# EasyEDA Pro project ProPrj_磁编码器AS5600_2025-07-28.epro

# Schematic Schematic1
Board Name: Board1; Create Date: 2025-05-22; Page Name: P1; Project Name: 磁编码器AS5600; Schematic Name: Schematic1; Update Date: 2025-05-22; Company: 嘉立创EDA; Page Size: A4; Version: V1.0
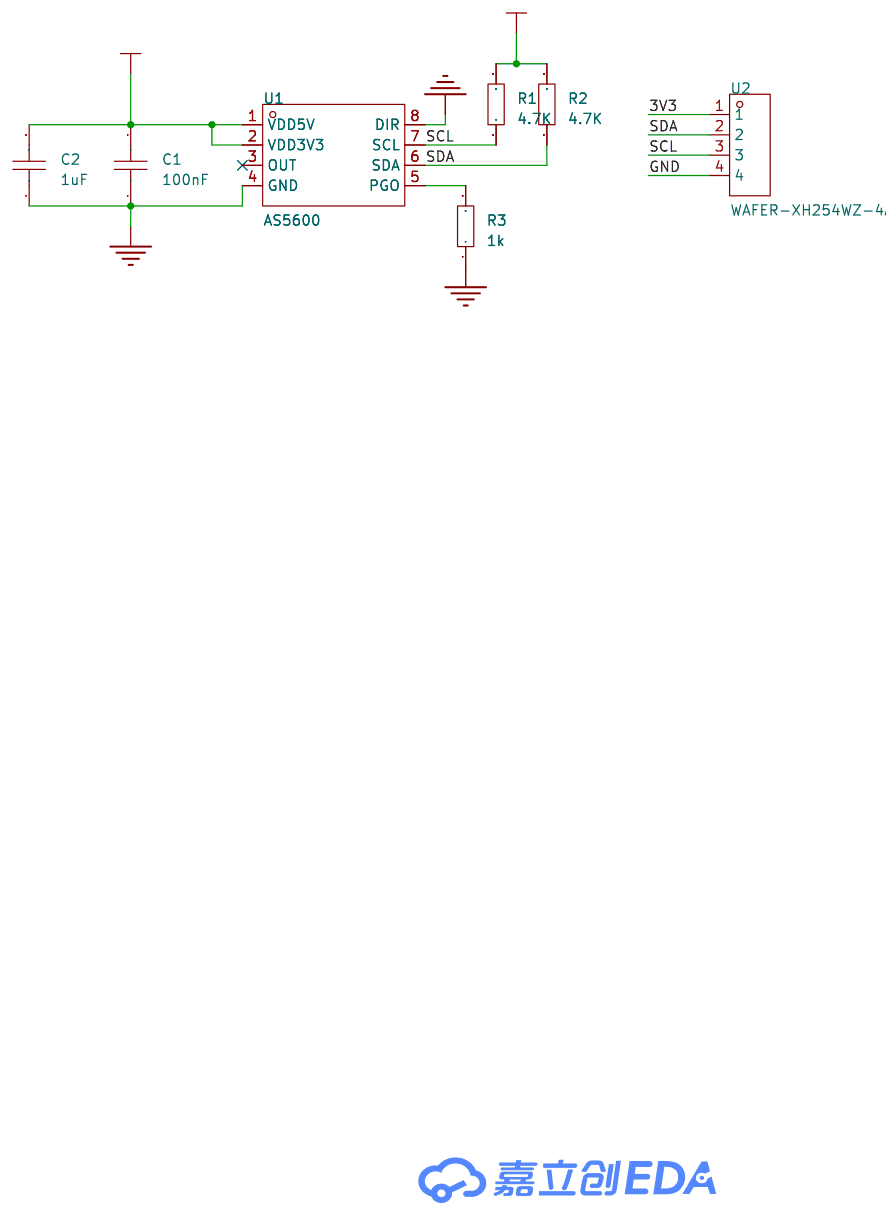
[diagram p0: schematic sheet]

## Parts
C1  100nF  [C0603]
C2  1uF  [C0603]
R1  4.7K  [R0603]
R2  4.7K  [R0603]
R3  1k  [R0603]
U1  AS5600  [SOIC-8_L4.9-W3.9-P1.27-LS6.0-BL]
U2  WAFER-XH254WZ-4A  [CONN-TH_4P-P2.50_WAFER-XH254WZ-4A]

## Library data of the parts
C1 C2 = CAP_0603: Supplier Footprint: 0603
R1-R3 = Res_0603: Supplier Footprint: 0603
U1 = AS5600: Supplier Part: C9900021040; Supplier Footprint: SOIC-8; JLCPCB Part Class: 扩展库; Supplier: LCSC
U2 = WAFER-XH254WZ-4A: 插针结构:1x4P;间距:2.54mm;安装方式:弯插;参考系列:XH;总PIN数:4P;排数:1;每排PIN数:4;额定电流:3A;触头材质:黄铜;工作温度:-25℃~+85℃;; LCSC Part Name: 1x4P 间距:2.54mm 弯插 系列:XH; Supplier Part: C7432693; Manufacturer: HANBO(汉博); Supplier Footprint: 插件,P=2.5mm; Datasheet: https://atta.szlcsc.com/upload/public/pdf/source/20230721/127D646758C1D4B76FEF9901992220E1.pdf; Supplier: LCSC; Pins Structure: 1x4P; Pitch: 2.54mm; Mounting Type: 弯插; Reference Series: XH; Number of Pins: 4P; Number of Rows: 1; Number of PINs Per Row: 4; Current Rating: 3A; Contact Material: 黄铜; Operating Temperature: -25℃~+85℃; Voltage Rating: 250V; Plastic Material: PA66; Flame Retardant Rating: UL94V-0

## Nets
3V3: C1.2 C2.2 R1.2 R2.2 U1.1(VDD5V) U1.2(VDD3V3) U2.1
GND: C1.1 C2.1 R3.1 U1.4(GND) U1.8(DIR) U2.4
SCL: R1.1 U1.7(SCL) U2.3
SDA: R2.1 U1.6(SDA) U2.2
$1N1180: R3.2 U1.5(PGO)

Not connected (* = marked no-connect by the designer): U1 3(OUT)*

# Board PCB1
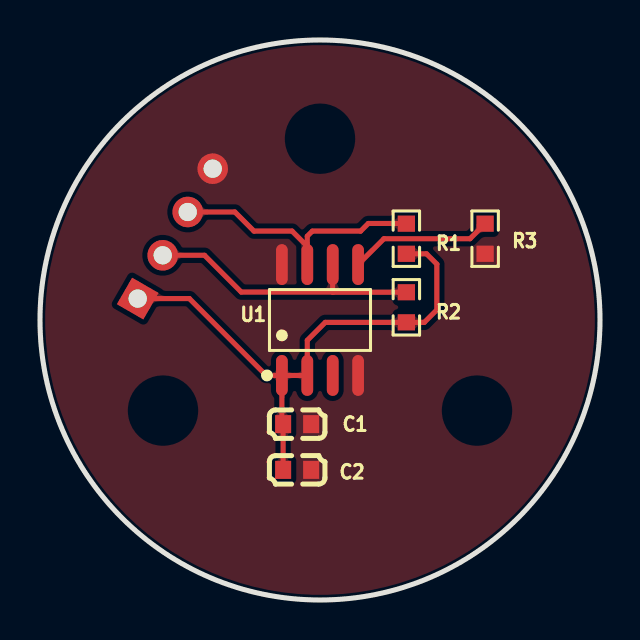
[diagram p1: board, top side]
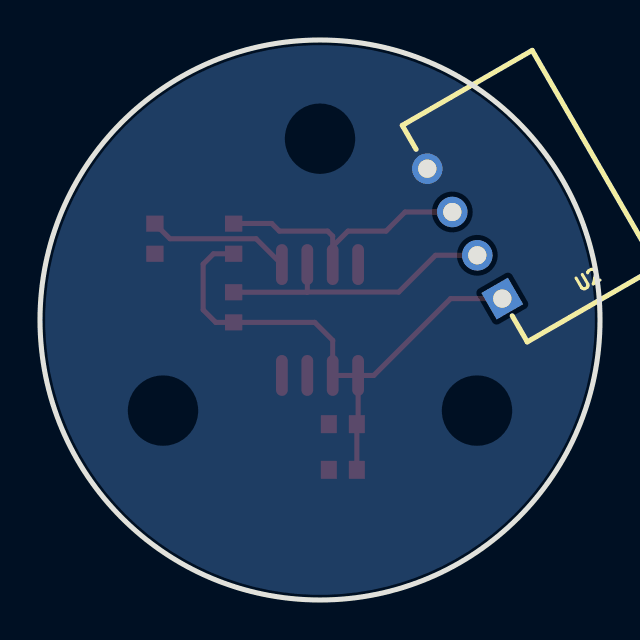
[diagram p2: board, bottom side, seen from below]

Outline 28 x 28 mm; copper layers: Top Layer, Bottom Layer. Coordinates in mm from the lower left corner of the outline.
Outline path: circle c14,14 r14
Stack: Top Layer 0.035mm / Dielectric1 1.51mm FR4 er 4.5 / Bottom Layer 0.035mm

## Design rules (mm)
template: 自定义配置
spacing copperThickness1oz (default): track to track 0.102, other pairs 0.152 to 0.3
spacing copperThickness2oz: track to track 0.203, other pairs 0.152 to 0.3
track width copperThickness1oz (default): min 0.127, default 0.254, max 2.54
track width copperThickness2oz: min 0.203, default 0.254, max 2.54
differential pair differentialPair (default): width min 0.127, default 0.254, max 2.54; gap min 0.152, default 0.152
via viaSize (default): diameter min 0.5, default 0.61, max 10; hole min 0.3, default 0.305, max 6.3

## Placement (name value [footprint] x y rotation side)
C1  100nF  [C0603]  12.86 8.79 180 top
C2  1uF  [C0603]  12.86 6.51 180 top
R1  4.7K  [R0603]  18.32 18.06 270 top
R2  4.7K  [R0603]  18.32 14.64 270 top
R3  1k  [R0603]  22.25 18.06 90 top
U1  AS5600  [SOIC-8_L4.9-W3.9-P1.27-LS6.0-BL]  14 14 0 top
U2  WAFER-XH254WZ-4A  [CONN-TH_4P-P2.50_WAFER-XH254WZ-4A]  6.76 18.32 60 bottom

## Footprints (pads in the part's own frame, mm; a bottom-side part is the same pattern mirrored in y, then rotated)
C0603
  rect 0.8x0.9 smd: 1(-0.7,0) 2(0.7,0)
CONN-TH_4P-P2.50_WAFER-XH254WZ-4A
  rect 1.524x1.524 hole 0.914: 1(-3.75,0)
  round 1.524 hole 0.914: 2(-1.25,0) 3(1.25,0) 4(3.75,0)
R0603
  rect 0.806x0.864 smd: 1(-0.753,0) 2(0.753,0)
SOIC-8_L4.9-W3.9-P1.27-LS6.0-BL
  oval 0.588x2.045 smd: 1(-1.905,-2.772) 2(-0.635,-2.772) 3(0.635,-2.772) 4(1.905,-2.772) 5(1.905,2.772) 6(0.635,2.772) 7(-0.635,2.772) 8(-1.905,2.772)

## Nets
As in the schematic.

Pads without a net: U1 3

## Routing (per net, layer and track width the routed paths; a pad name or vN(x,y) marks a point on that pad's centre or on a via; arc(x,y) is an arc through that point)
3V3: length 27.7
  Top Layer w0.254: R1.2 19.33,17.31 19.84,16.79 19.84,14.51 19.22,13.88 R2.2 14.26,13.88 13.37,12.98 U1.2 U1.1 ; U1.1 12.09,8.86 C1.2 C2.2 ; U1.1 11.31,11.23 7.47,15.07 U2.1
SCL: length 13.3
  Top Layer w0.254: R1.1 18.31,18.83 16.41,18.83 16.03,18.44 13.62,18.44 13.37,18.19 13.37,17.68 ; 13.37,17.68 U1.7 ; 13.37,17.68 12.6,18.44 10.7,18.44 9.74,19.4 U2.3
SDA: length 14.3
  Top Layer w0.254: R2.1 14.64,15.39 14.63,15.4 ; U2.2 8.22,17.24 10.06,15.4 14.63,15.4 ; 14.63,15.4 U1.6
$1N1180: length 7.2
  Top Layer w0.254: U1.5 17.2,18.06 21.5,18.06 R3.2

## Copper pours and planes (outline as drawn; the poured copper is in the pictures)
GND on Top Layer: -4.41,31.65 32.92,31.65 32.92,-2 -4.41,-2
GND on Bottom Layer: -3.27,30.38 30.76,30.38 30.76,-0.73 -3.27,-0.73

Small or netless copper shapes (teardrops, artwork), in the pictures only: 22 on Top Layer
